# Altium schematic sheet SENSOR.SchDoc
size A; SheetNumber: 4; SheetTotal: 7
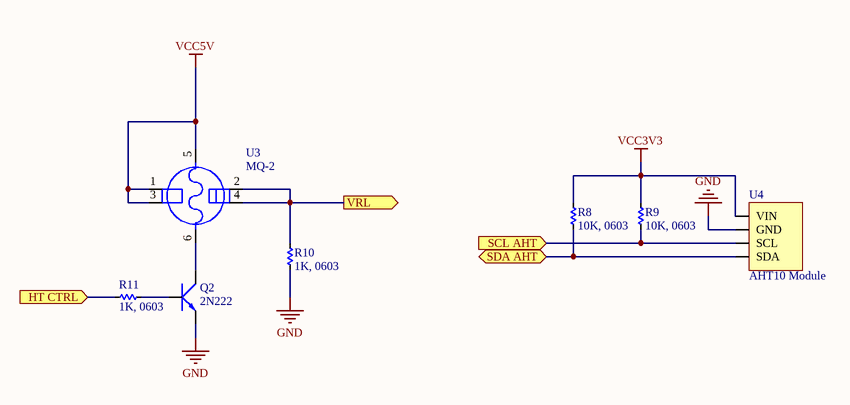
[diagram p0: SENSOR.SchDoc]

## Parts
Q2  2N222  [TO92-123]
R8  10K, 0603  [RES-SMD-0603]
R9  10K, 0603  [RES-SMD-0603]
R10  1K, 0603  [RES-SMD-0603]
R11  1K, 0603  [RES-SMD-0603]
U3  MQ-2  [SNR6-D19.0MM]
U4  AHT10 Module

## Ports
HT CTRL (in), SCL AHT (in), SDA AHT (bidir), VRL (out)

## Nets
GND: Q2.1(E) R10.2 U4.5(GND)
VCC3V3: R8.2 R9.2 U4.4(VIN)
VCC5V: U3.1(A0) U3.3(A1) U3.5(H@1)
HT CTRL: R11.2 ; port HT CTRL
SCL AHT: R9.1 U4.?1(SCL) ; port SCL AHT
SDA AHT: R8.1 U4.7(SDA) ; port SDA AHT
VRL: R10.1 U3.2(B0) U3.4(B1) ; port VRL
NetQ2_2: Q2.2(B) R11.1
NetQ2_3: Q2.3(C) U3.6(H@2)

## Library data of the parts
Q2 = 2N222: NPN 600mW, ECB; Value: C1815
R8-R11 = Res-SMD: Resistor; Manufacturer: Generic Components; Class: Passive; Published: 08/06/2000; Publisher: Altium Hobart Technology Centre
U3 = DIP-GAS-MQ-2(6P-D19MM): 314100003; MF: {'manufacturer': u'AirBorn'}; Package: None; Price: None; Value: *; MP: MQ-2; Availability: Unavailable
U4 = AHT10